# Altium schematic sheet 03_Top_STM_Maestro.SchDoc
size A4; SheetNumber: 11; SheetTotal: 28
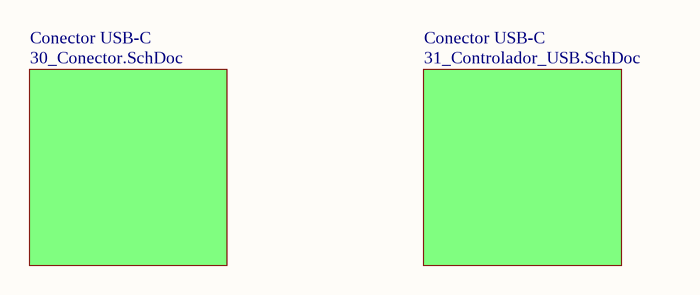
[diagram p0: 03_Top_STM_Maestro.SchDoc]

## Sub-sheets
Conector USB-C = 30_Conector.SchDoc: no entries
Conector USB-C = 31_Controlador_USB.SchDoc: no entries